# EAGLE schematic iot_actuator_shield (EAGLE 7.4.0)
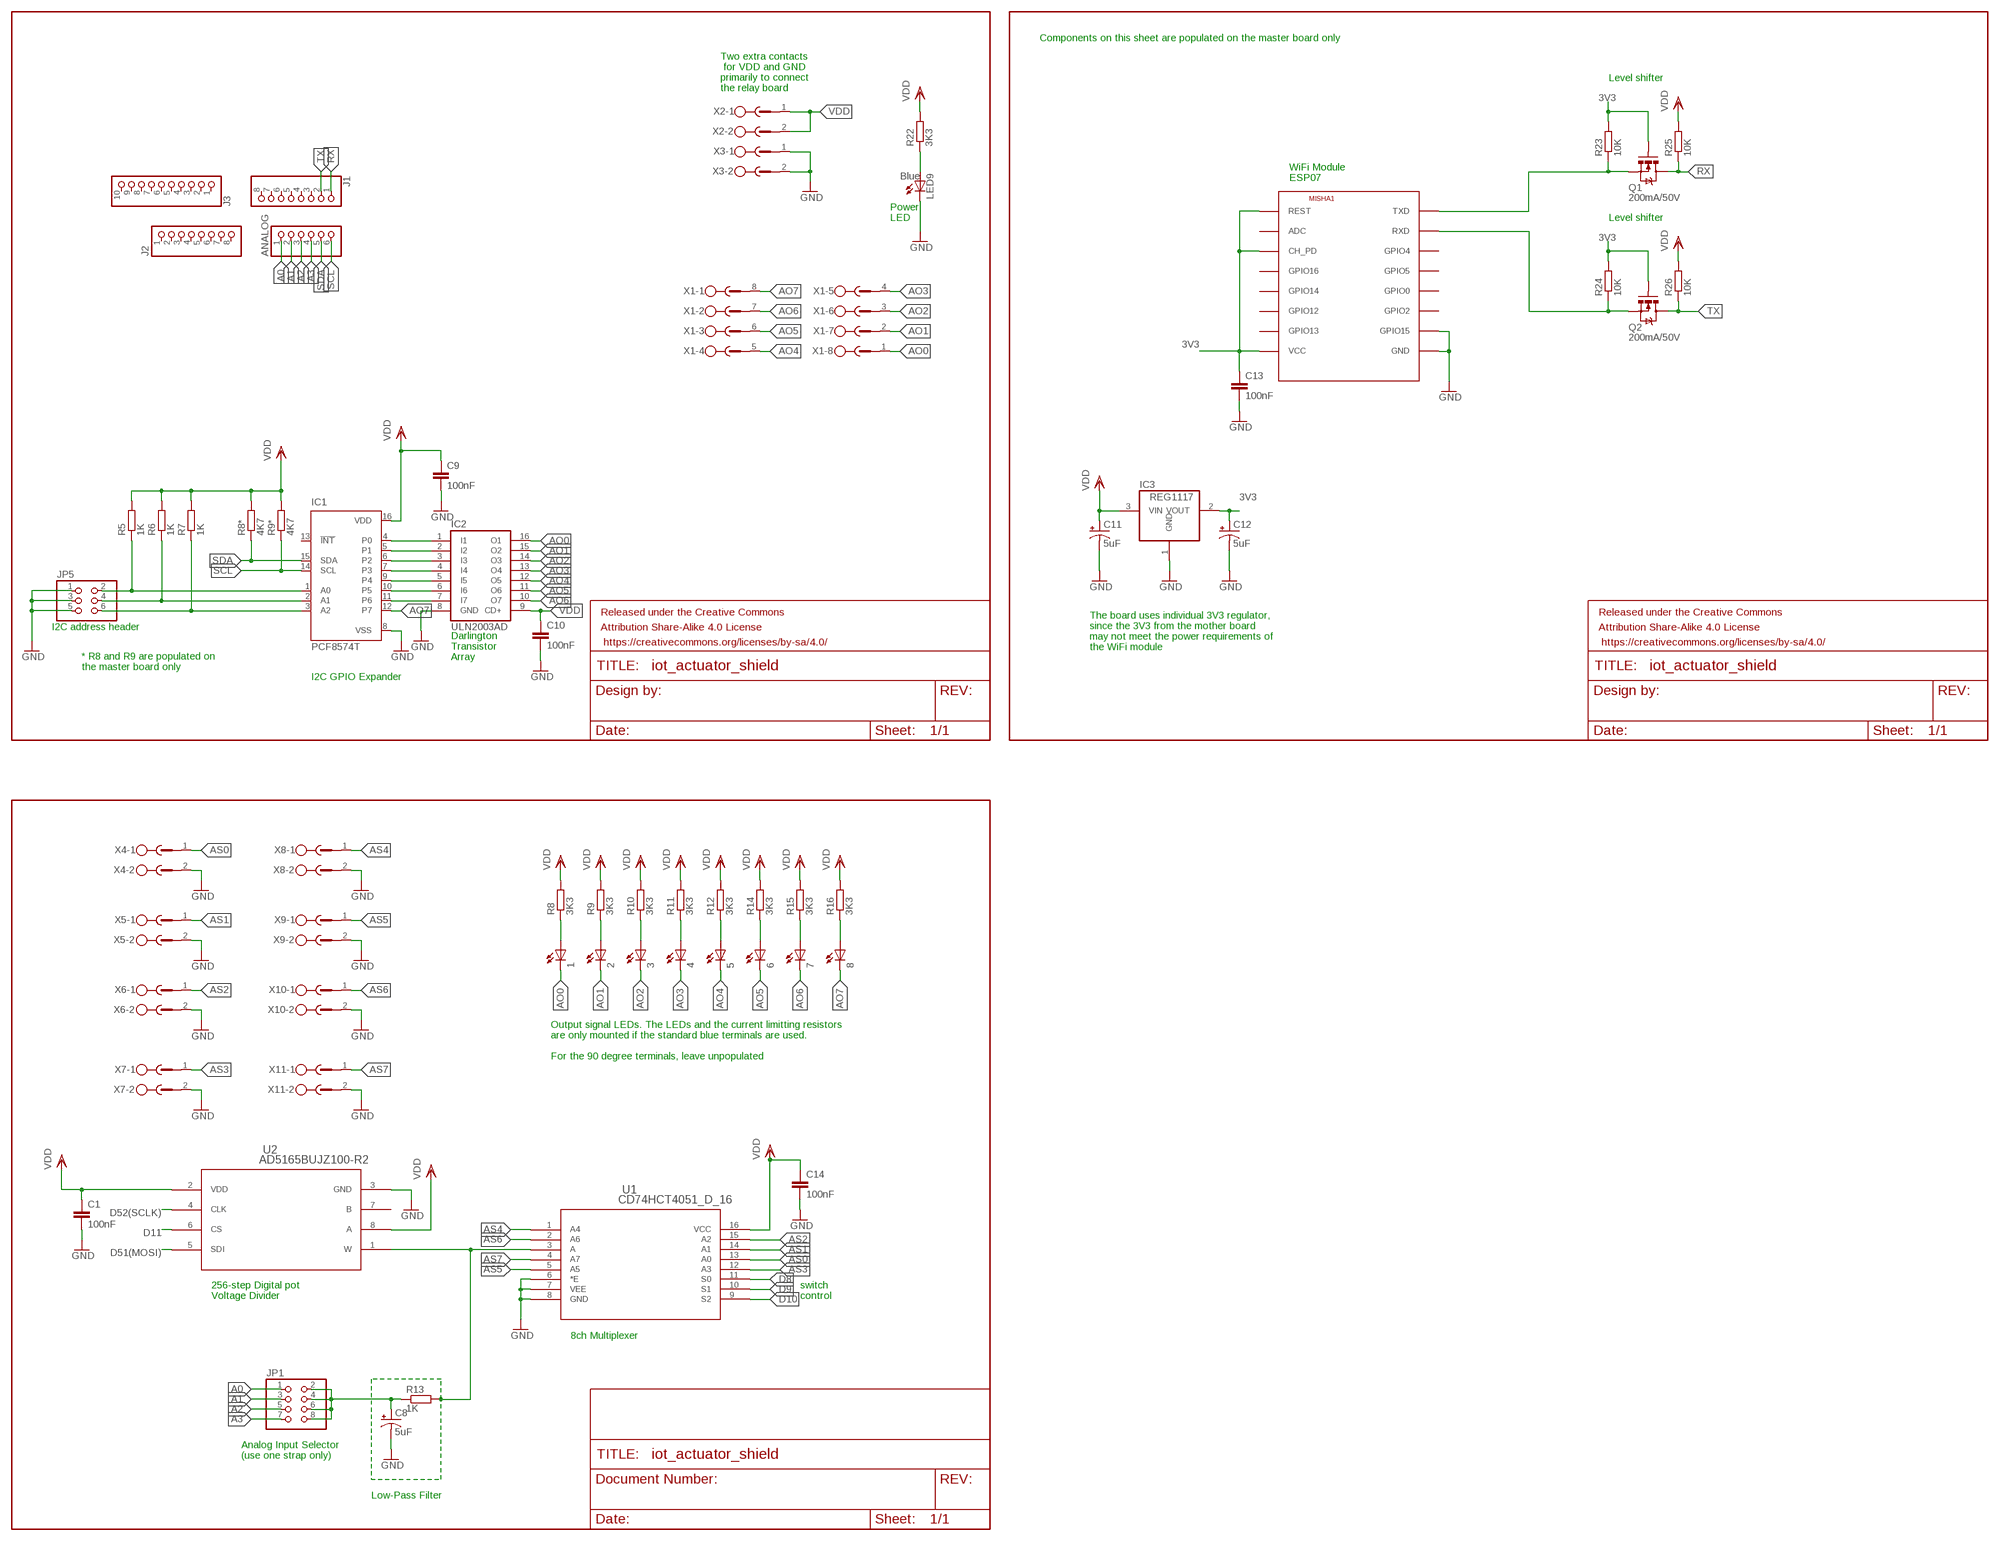
[diagram p0: schematic, sheet 1]

## Parts
1  LEDCHIP-LED0805  [CHIP-LED0805]
2  LEDCHIP-LED0805  [CHIP-LED0805]
3  LEDCHIP-LED0805  [CHIP-LED0805]
4  LEDCHIP-LED0805  [CHIP-LED0805]
5  LEDCHIP-LED0805  [CHIP-LED0805]
6  LEDCHIP-LED0805  [CHIP-LED0805]
7  LEDCHIP-LED0805  [CHIP-LED0805]
8  LEDCHIP-LED0805  [CHIP-LED0805]
ANALOG  PINHD-1X6  [1X06]
C1  100nF  C-EUC0805  [C0805]
C8  5uF  CAP_POL1206  [EIA3216]
C9  100nF  C-EUC0805  [C0805]
C10  100nF  C-EUC0805  [C0805]
C11  5uF  CAP_POL1206  [EIA3216]
C12  5uF  CAP_POL1206  [EIA3216]
C13  100nF  C-EUC0805  [C0805]
C14  100nF  C-EUC0805  [C0805]
FRAME1  FRAME-LETTER  [CREATIVE_COMMONS]
FRAME2  FRAME-LETTER  [CREATIVE_COMMONS]
IC1  PCF8574T  [SO16W]
IC2  ULN2003AD  [SO16]
IC3  REG1117  [SOT223]
J1  PINHD-1X8TH  [1X08-TH]
J2  PINHD-1X8TH  [1X08-TH]
J3  PINHD-1X10TH  [1X10-TH]
JP1  PINHD-2X4  [2X04]
JP5  PINHD-2X3  [2X03]
LED9  Blue  LEDCHIP-LED0805  [CHIP-LED0805]
MISHA1  ESP8266-07  [ESP-07]
Q1  200mA/50V  MOSFET-NCHANNELBSS138  [SOT23-3]
Q2  200mA/50V  MOSFET-NCHANNELBSS138  [SOT23-3]
R5  1K  R-EU_R0805  [R0805]
R6  1K  R-EU_R0805  [R0805]
R7  1K  R-EU_R0805  [R0805]
R8  3K3  R-EU_R0805  [R0805]
R8*  4K7  R-EU_R0805  [R0805]
R9  3K3  R-EU_R0805  [R0805]
R9*  4K7  R-EU_R0805  [R0805]
R10  3K3  R-EU_R0805  [R0805]
R11  3K3  R-EU_R0805  [R0805]
R12  3K3  R-EU_R0805  [R0805]
R13  1K  R-EU_R1206  [R1206]
R14  3K3  R-EU_R0805  [R0805]
R15  3K3  R-EU_R0805  [R0805]
R16  3K3  R-EU_R0805  [R0805]
R22  3K3  R-EU_R0805  [R0805]
R23  10K  R-EU_R0805  [R0805]
R24  10K  R-EU_R0805  [R0805]
R25  10K  R-EU_R0805  [R0805]
R26  10K  R-EU_R0805  [R0805]
U1  CD74HCT4051_D_16  [D16]
U2  AD5165BUJZ100-R2  [UJ_8]
X1  MSTBV8  [MSTBV8]
X2  MSTBV2  [MSTBV2]
X3  MSTBV2  [MSTBV2]
X4  MSTBV2  [MSTBV2]
X5  MSTBV2  [MSTBV2]
X6  MSTBV2  [MSTBV2]
X7  MSTBV2  [MSTBV2]
X8  MSTBV2  [MSTBV2]
X9  MSTBV2  [MSTBV2]
X10  MSTBV2  [MSTBV2]
X11  MSTBV2  [MSTBV2]

## Nets
3V3: C12.A(+) C13.1 IC3.2(VOUT) MISHA1.CH_PD MISHA1.REST MISHA1.VCC Q1.1(G) Q2.1(G) R23.2 R24.2
A0: ANALOG.1 JP1.1
A1: ANALOG.2 JP1.3
A2: ANALOG.3 JP1.5
A3: ANALOG.4 JP1.7
AO0: 1.C IC2.16(O1) X1.1
AO1: 2.C IC2.15(O2) X1.2
AO2: 3.C IC2.14(O3) X1.3
AO3: 4.C IC2.13(O4) X1.4
AO4: 5.C IC2.12(O5) X1.5
AO5: 6.C IC2.11(O6) X1.6
AO6: 7.C IC2.10(O7) X1.7
AO7: 8.C IC1.12(P7) X1.8
AS0: U1.13(A0) X4.1
AS1: U1.14(A1) X5.1
AS2: U1.15(A2) X6.1
AS3: U1.12(A3) X7.1
AS4: U1.1(A4) X8.1
AS5: U1.5(A5) X9.1
AS6: U1.2(A6) X10.1
AS7: U1.4(A7) X11.1
D8: U1.11(S0)
D9: U1.10(S1)
D10: U1.9(S2)
D11: U2.6(CS)
D51(MOSI): U2.5(SDI)
D52(SCLK): U2.4(CLK)
GND: C1.2 C8.C(-) C9.2 C10.2 C11.C(-) C12.C(-) C13.2 C14.2 IC1.8(VSS) IC2.8(GND) IC3.1(GND) JP5.1 JP5.3 JP5.5 LED9.C MISHA1.GND MISHA1.GPIO15 U1.6(*E) U1.7(VEE) U1.8(GND) U2.3(GND) X3.1 X3.2 X4.2 X5.2 X6.2 X7.2 X8.2 X9.2 X10.2 X11.2
N$1: JP1.2 JP1.4 JP1.6 JP1.8
N$2: R13.2 U1.3(A) U2.1(W)
N$3: IC1.4(P0) IC2.1(I1)
N$4: IC1.5(P1) IC2.2(I2)
N$5: IC1.6(P2) IC2.3(I3)
N$6: IC1.7(P3) IC2.4(I4)
N$7: IC1.9(P4) IC2.5(I5)
N$8: IC1.10(P5) IC2.6(I6)
N$9: IC1.11(P6) IC2.7(I7)
N$10: IC1.1(A0) JP5.2 R5.1
N$11: 1.A R8.1
N$23: 2.A R9.1
N$24: IC1.2(A1) JP5.4 R6.1
N$25: IC1.3(A2) JP5.6 R7.1
N$32: 3.A R10.1
N$36: C8.A(+) R13.1
N$40: MISHA1.TXD Q1.2(S) R23.1
N$41: MISHA1.RXD Q2.2(S) R24.1
N$46: 4.A R11.1
N$47: 5.A R12.1
N$48: 6.A R14.1
N$49: 7.A R15.1
N$50: 8.A R16.1
N$126: LED9.A R22.1
RX: J1.1 Q1.3(D) R25.1
SCL: ANALOG.6 IC1.14(SCL) R9*.1
SDA: ANALOG.5 IC1.15(SDA) R8*.1
TX: J1.2 Q2.3(D) R26.1
VDD: C1.1 C9.1 C10.1 C11.A(+) C14.1 IC1.16(VDD) IC2.9(CD+) IC3.3(VIN) R5.2 R6.2 R7.2 R8*.2 R8.2 R9*.2 R9.2 R10.2 R11.2 R12.2 R14.2 R15.2 R16.2 R22.2 R25.2 R26.2 U1.16(VCC) U2.2(VDD) U2.8(A) X2.1 X2.2
Unconnected: IC1.13(!INT) J1.3 J1.4 J1.5 J1.6 J1.7 J1.8 J2.1 J2.2 J2.3 J2.4 J2.5 J2.6 J2.7 J2.8 J3.1 J3.2 J3.3 J3.4 J3.5 J3.6 J3.7 J3.8 J3.9 J3.10 MISHA1.ADC MISHA1.GPIO0 MISHA1.GPIO2 MISHA1.GPIO4 MISHA1.GPIO5 MISHA1.GPIO12 MISHA1.GPIO13 MISHA1.GPIO14 MISHA1.GPIO16 U2.7(B)

## Notes on the sheet
- Components on this sheet are populated on the master board only
- Level shifter
- Two extra contacts
   for VDD and GND 
  primarily to connect 
  the relay board
- WiFi Module
  ESP07
- Power 
  LED
- Level shifter
- I2C address header
- The board uses individual 3V3 regulator,
  since the 3V3 from the mother board
  may not meet the power requirements of 
  the WiFi module
- Darlington 
  Transistor 
  Array
- * R8 and R9 are populated on 
  the master board only
- I2C GPIO Expander
- Output signal LEDs. The LEDs and the current limitting resistors 
  are only mounted if the standard blue terminals are used.
  
  For the 90 degree terminals, leave unpopulated
- 256-step Digital pot
  Voltage Divider
- switch
  control
- 8ch Multiplexer
- Analog Input Selector
  (use one strap only)
- Low-Pass Filter

## Library data of the parts
1-8 LED9 = led:LED: LED OSRAM: - CHIPLED LG R971, LG N971, LY N971, LG Q971, LY Q971, LO R971, LY R971 LH N974, LH R974 LS Q976, LO Q976, LY Q976 LO Q996 - Hyper CHIPLED LW Q18S LB Q993, LB Q99A, LB R99A - SideLED LS A670, LO A670, LY A670, LG A670, LP A670 LB A673, LV A673, LT A673, LW A673 LH A674 LY A675 LS A676, LA A676, LO A676, LY A676, LW A676 LS A679, LY A679, LG A679 - Hyper Micro SIDELED® LS Y876, LA Y876, LO Y876, LY Y876 LT Y87S - SmartLED LW L88C, LW L88S LB L89C, LB L89S, LG L890 LS L89K, LO L89K, LY L89K LS L896, LA L896, LO L896, LY L896 - TOPLED LS T670, LO T670, LY T670, LG T670, LP T670 LSG T670, LSP T670, LSY T670, LOP T670, LYG T670 LG T671, LOG T671, LSG T671 LB T673, LV T673, LT T673, LW T673 LH T674 LS T676, LA T676, LO T676, LY T676, LB T676, LH T676, LSB T676, LW T676 LB T67C, LV T67C, LT T67C, LS T67K, LO T67K, LY T67K, LW E67C LS E67B, LA E67B, LO E67B, LY E67B, LB E67C, LV E67C, LT E67C LW T67C LS T679, LY T679, LG T679 LS T770, LO T770, LY T770, LG T770, LP T770 LB T773, LV T773, LT T773, LW T773 LH T774 LS E675, LA E675, LY E675, LS T675 LS T776, LA T776, LO T776, LY T776, LB T776 LHGB T686 LT T68C, LB T68C - Hyper Mini TOPLED® LB M676 - Mini TOPLED Santana® LG M470 LS M47K, LO M47K, LY M47K Source: http://www.osram.convergy.de LUXEON: - LUMILED® LXK2-PW12-R00, LXK2-PW12-S00, LXK2-PW14-U00, LXK2-PW14-V00 LXK2-PM12-R00, LXK2-PM12-S00, LXK2-PM14-U00 LXK2-PE12-Q00, LXK2-PE12-R00, LXK2-PE12-S00, LXK2-PE14-T00, LXK2-PE14-U00 LXK2-PB12-K00, LXK2-PB12-L00, LXK2-PB12-M00, LXK2-PB14-N00, LXK2-PB14-P00, LXK2-PB14-Q00 LXK2-PR12-L00, LXK2-PR12-M00, LXK2-PR14-Q00, LXK2-PR14-R00 LXK2-PD12-Q00, LXK2-PD12-R00, LXK2-PD12-S00 LXK2-PH12-R00, LXK2-PH12-S00 LXK2-PL12-P00, LXK2-PL12-Q00, LXK2-PL12-R00 Source: www.luxeon.com KINGBRIGHT: KA-3528ASYC Source: www.kingbright.com
ANALOG = pinhead:PINHD-1X6: PIN HEADER
C1 C9 C10 C13 C14 = rcl:C-EU: CAPACITOR, European symbol
C8 C11 C12 = SparkFun-Capacitors:CAP_POL: Capacitor Polarized These are standard SMD and PTH capacitors. Normally 10uF, 47uF, and 100uF in electrolytic and tantalum varieties. Always verify the external diameter of the through hole cap, it varies with capacity, voltage, and manufacturer. The EIA devices should be standard.
FRAME1 FRAME2 = SparkFun-Aesthetics:FRAME-LETTER: Schematic Frame Standard 8.5x11 US Letter frame
IC1 = micro-philips:PCF8574: I2C-Bus Remote 8-bit I/O expander http://www.semiconductors.philips.com/acrobat_download/datasheets/PCF8574_4.pdf; MPN: PCF8574T/3,512; OC_FARNELL: 1201255; OC_NEWARK: 70R6870
IC2 = uln-udn:ULN2003A: DRIVER ARRAY
IC3 = burr-brown:REG1117: 800mA and 1A Low Dropout (LDO) Positive Regulator 1.8V, 2.5V, 2.85V, 3.3V, 5V, and Adj; MPN: REG1117; OC_FARNELL: 1097566; OC_NEWARK: 14P6981
J1 J2 = SmartPrj:PINHD-1X8: PIN HEADER
J3 = SmartPrj:PINHD-1X10: PIN HEADER
JP1 = pinhead:PINHD-2X4: PIN HEADER
JP5 = pinhead:PINHD-2X3: PIN HEADER
MISHA1 = lio:ESP8266
Q1 Q2 = SparkFun-DiscreteSemi:MOSFET-NCHANNEL: Common NMOSFET Parts MFG P/N Store ID Prod ID FDD8780 TRANS-09984 SI7820DN TRANS-11055 FDS6630A IC-08089 2N7002PW TRANS-11151 FQP30N06L COM-10213 TRANS-10060 BSS123LT1G TRANS-08345 BSS138 TRANS-00830 BS170 2N7000; PROD_ID: TRANS-00830
R5-R8 R8* R9 R9* R10-R16 R22-R26 = rcl:R-EU_: RESISTOR, European symbol
U1 = misha-74HCT4051:CD74HCT4051_D_16; DATASHEETURL: http://www.ti.com/lit/gpn/CD74HCT4051; DESCRIPTION: High Speed CMOS 8-Channel Analog Multiplexer/Demultiplexer with TTL inputs; FAMILY_NAME: ANALOG SWITCH/MULTIPLEXER(less than or equal to 5V); GENERIC_PART_NUMBER: CD74HCT4051; INDUSTRY_STD_PKG_TYPE: SOIC; MANUFACTURER: Texas Instruments; PACKAGE_DESIGNATOR: D; PIN_COUNT: 16
U2 = AD5165_DigitalPot:AD5165BUJZ100-R2
X1 = con-phoenix-500:MSTBV8: PHOENIX; OC_FARNELL: unknown; OC_NEWARK: unknown
X2-X11 = con-phoenix-500:MSTBV2: PHOENIX; OC_FARNELL: unknown; OC_NEWARK: unknown